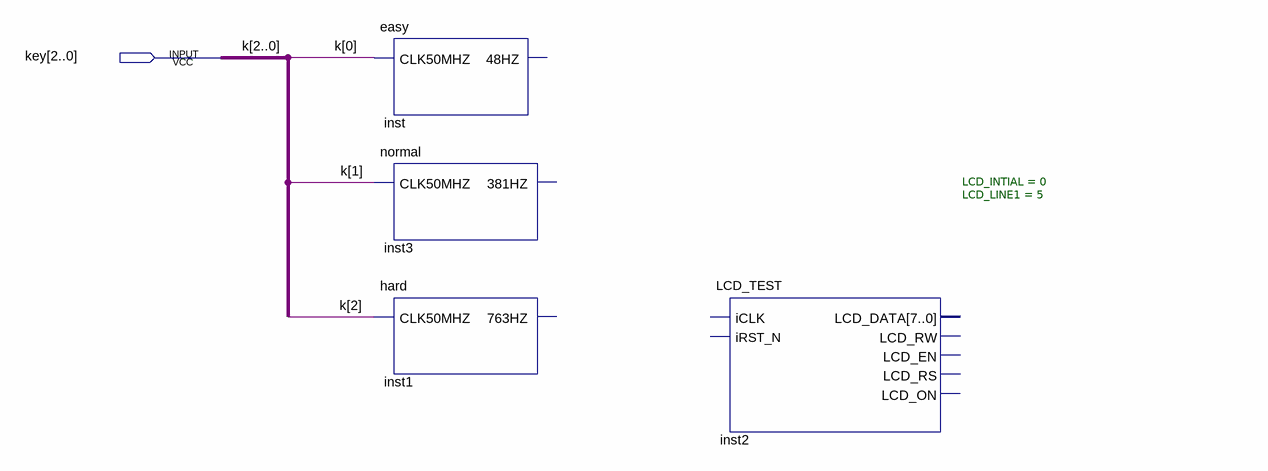
[diagram p0: schematic sheet]
// Quartus schematic Final.bdf as structural Verilog: 4 symbols, 1 pins
module Final (
  input  [2:0] key
);

  easy inst (.CLK50MHZ(key[0]));  // open: 48HZ
  normal inst3 (.CLK50MHZ(key[1]));  // open: 381HZ
  hard inst1 (.CLK50MHZ(key[2]));  // open: 763HZ
  LCD_TEST #(.LCD_INTIAL(0), .LCD_LINE1(5)) inst2 ();  // open: iCLK, iRST_N, LCD_DATA, LCD_RW, LCD_EN, LCD_RS, LCD_ON

  // Other names for the same wires on the sheet: k[2:0] = key
endmodule
